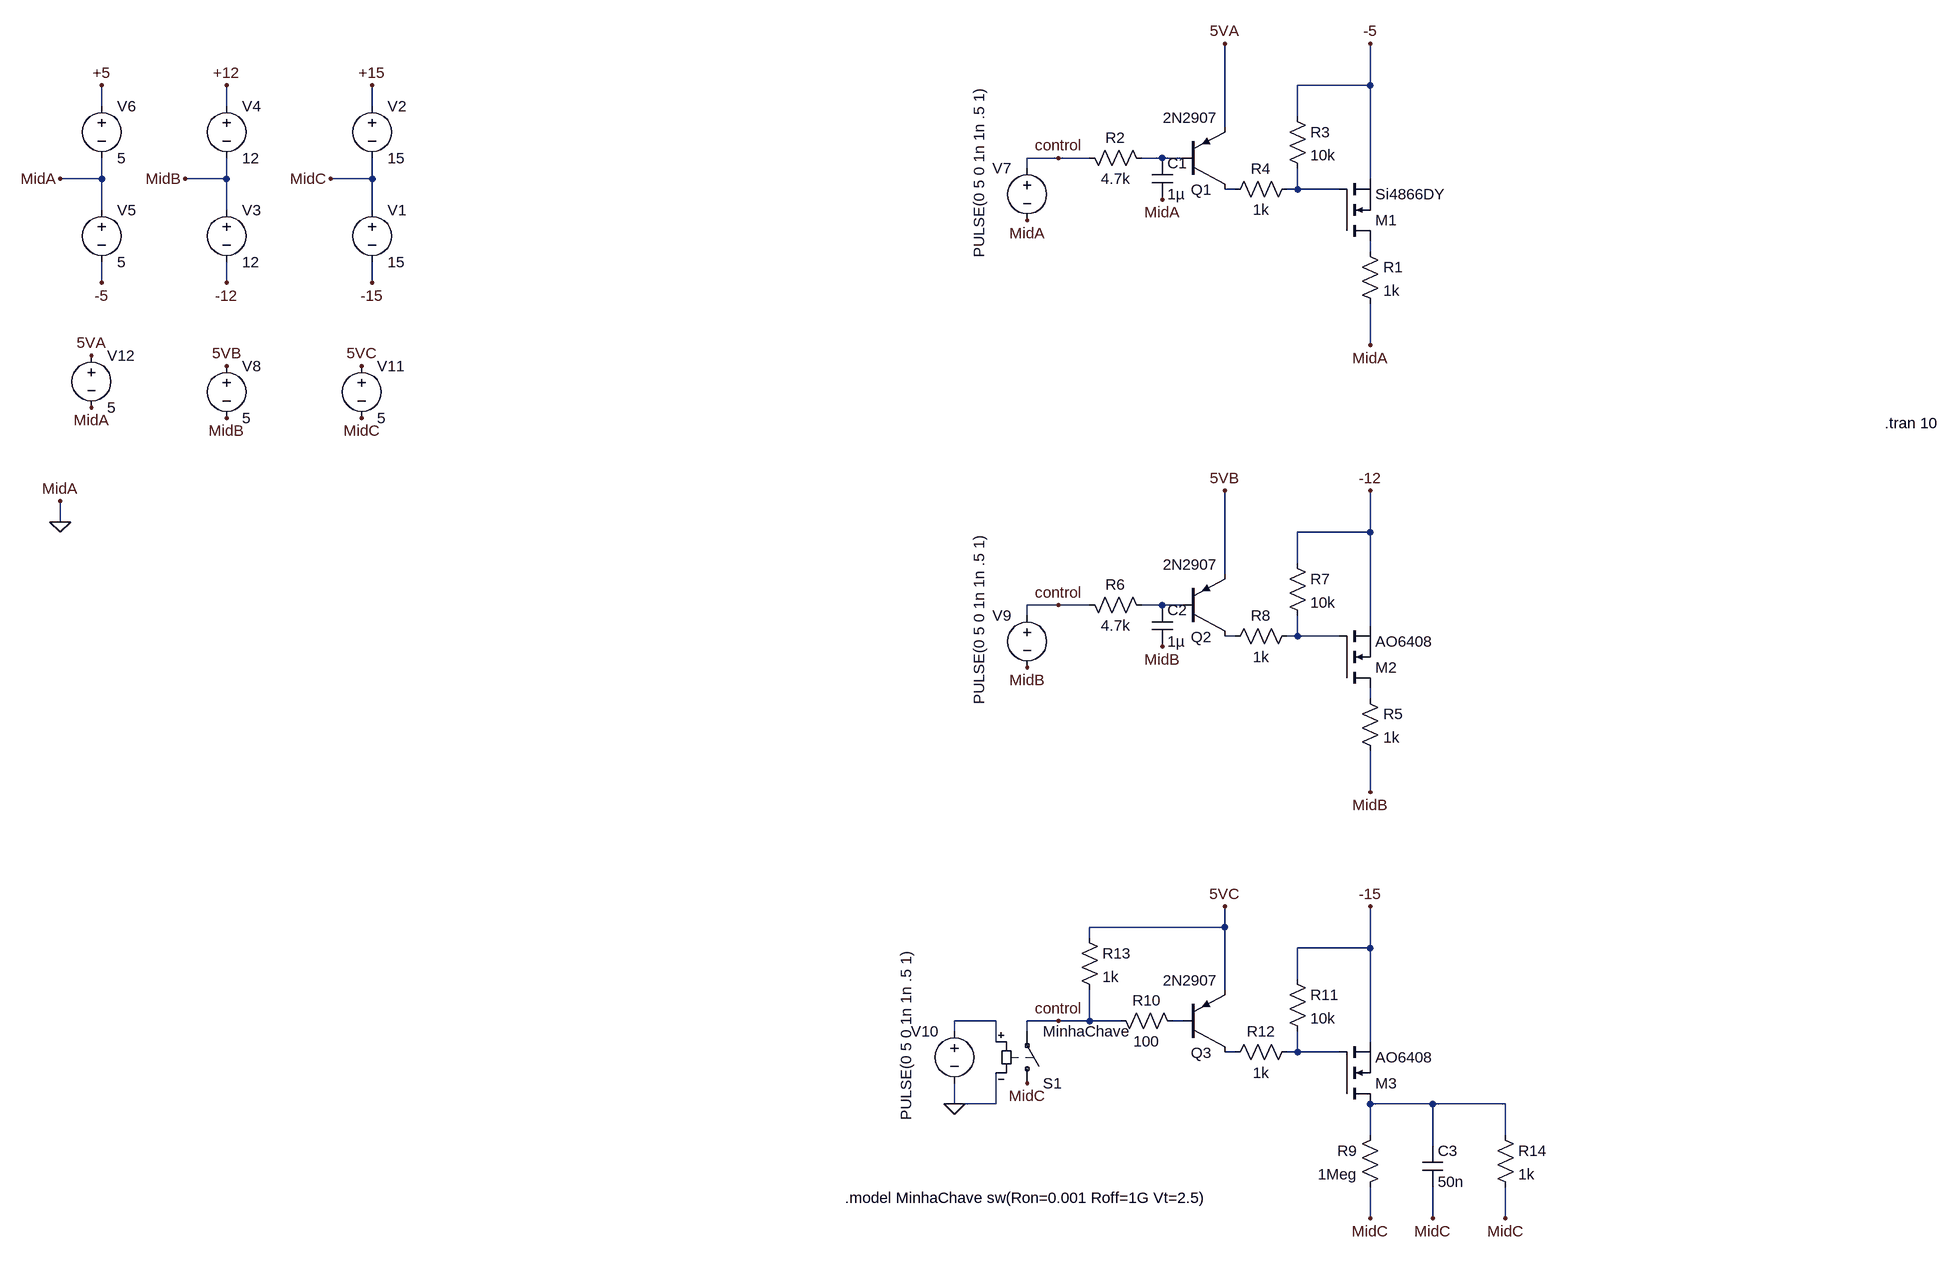
[diagram p0: schematic negativeSwitch.asc]
negativeSwitch.asc, the LTspice schematic file:
Version 4.1
SHEET 1 1944 1796
WIRE 416 -96 416 -160
WIRE 416 -96 304 -96
WIRE -1536 -64 -1536 -96
WIRE -1344 -64 -1344 -96
WIRE -1120 -64 -1120 -96
WIRE 304 -48 304 -96
WIRE 192 -32 192 -160
WIRE -64 16 -112 16
WIRE -16 16 -64 16
WIRE 96 16 64 16
WIRE 128 16 96 16
WIRE -112 32 -112 16
WIRE -1536 48 -1536 16
WIRE -1536 48 -1600 48
WIRE -1344 48 -1344 16
WIRE -1344 48 -1408 48
WIRE -1120 48 -1120 16
WIRE -1120 48 -1184 48
WIRE 416 48 416 -96
WIRE 208 64 192 64
WIRE 304 64 304 32
WIRE 304 64 288 64
WIRE 368 64 304 64
WIRE -1536 96 -1536 48
WIRE -1344 96 -1344 48
WIRE -1120 96 -1120 48
WIRE 416 160 416 144
WIRE -1536 208 -1536 176
WIRE -1344 208 -1344 176
WIRE -1120 208 -1120 176
WIRE 416 304 416 240
WIRE -1600 576 -1600 544
WIRE 416 592 416 528
WIRE 416 592 304 592
WIRE 304 640 304 592
WIRE 192 656 192 528
WIRE -64 704 -112 704
WIRE -16 704 -64 704
WIRE 96 704 64 704
WIRE 128 704 96 704
WIRE -112 720 -112 704
WIRE 416 736 416 592
WIRE 208 752 192 752
WIRE 304 752 304 720
WIRE 304 752 288 752
WIRE 368 752 304 752
WIRE 416 848 416 832
WIRE 416 992 416 928
WIRE 192 1200 192 1168
WIRE 192 1200 -16 1200
WIRE -16 1216 -16 1200
WIRE 416 1232 416 1168
WIRE 416 1232 304 1232
WIRE 304 1280 304 1232
WIRE 192 1296 192 1200
WIRE -160 1344 -224 1344
WIRE -64 1344 -112 1344
WIRE -16 1344 -16 1296
WIRE -16 1344 -64 1344
WIRE 32 1344 -16 1344
WIRE 128 1344 112 1344
WIRE -224 1360 -224 1344
WIRE -112 1360 -112 1344
WIRE -160 1376 -160 1344
WIRE 416 1376 416 1232
WIRE 208 1392 192 1392
WIRE 304 1392 304 1360
WIRE 304 1392 288 1392
WIRE 368 1392 304 1392
WIRE -224 1472 -224 1440
WIRE -160 1472 -160 1424
WIRE -160 1472 -224 1472
WIRE 512 1472 416 1472
WIRE 624 1472 512 1472
WIRE 416 1520 416 1472
WIRE 624 1520 624 1472
WIRE 512 1536 512 1472
WIRE 416 1648 416 1600
WIRE 512 1648 512 1600
WIRE 624 1648 624 1600
FLAG -1120 208 -15
FLAG -1120 -96 +15
FLAG -1184 48 MidC
FLAG -1344 336 5VB
FLAG -64 16 control
FLAG -1344 208 -12
FLAG -1344 -96 +12
FLAG -1536 208 -5
FLAG -1536 -96 +5
FLAG -1600 48 MidA
FLAG -64 704 control
FLAG -64 1344 control
FLAG 416 1168 -15
FLAG 416 -160 -5
FLAG 416 528 -12
FLAG -1408 48 MidB
FLAG 416 304 MidA
FLAG 96 80 MidA
FLAG -112 112 MidA
FLAG 416 992 MidB
FLAG 96 768 MidB
FLAG -112 800 MidB
FLAG 416 1648 MidC
FLAG -112 1440 MidC
FLAG -1136 336 5VC
FLAG -1136 416 MidC
FLAG -1344 416 MidB
FLAG -1552 320 5VA
FLAG -1552 400 MidA
FLAG 192 -160 5VA
FLAG 192 528 5VB
FLAG 192 1168 5VC
FLAG -1600 544 MidA
FLAG -1600 576 0
FLAG -224 1472 0
FLAG 512 1648 MidC
FLAG 624 1648 MidC
SYMBOL nmos 368 144 M180
SYMATTR InstName M1
SYMATTR Value Si4866DY
SYMBOL voltage -1120 80 R0
WINDOW 123 0 0 Left 0
WINDOW 39 0 0 Left 0
SYMATTR InstName V1
SYMATTR Value 15
SYMBOL voltage -1120 -80 R0
WINDOW 123 0 0 Left 0
WINDOW 39 0 0 Left 0
SYMATTR InstName V2
SYMATTR Value 15
SYMBOL res 400 144 R0
SYMATTR InstName R1
SYMATTR Value 1k
SYMBOL voltage -112 16 M0
WINDOW 3 74 -110 VRight 2
WINDOW 123 0 0 Left 0
WINDOW 39 0 0 Left 0
SYMATTR Value PULSE(0 5 0 1n 1n .5 1)
SYMATTR InstName V7
SYMBOL voltage -1344 320 R0
WINDOW 123 0 0 Left 0
WINDOW 39 0 0 Left 0
SYMATTR InstName V8
SYMATTR Value 5
SYMBOL res -32 0 M90
WINDOW 0 0 56 VBottom 2
WINDOW 3 32 56 VTop 2
SYMATTR InstName R2
SYMATTR Value 4.7k
SYMBOL res 288 -64 R0
SYMATTR InstName R3
SYMATTR Value 10k
SYMBOL pnp 128 64 M180
WINDOW 0 12 -1 Left 2
WINDOW 3 -31 110 Left 2
SYMATTR InstName Q1
SYMATTR Value 2N2907
SYMBOL cap 80 16 R0
SYMATTR InstName C1
SYMATTR Value 1µ
SYMBOL voltage -1344 80 R0
WINDOW 123 0 0 Left 0
WINDOW 39 0 0 Left 0
SYMATTR InstName V3
SYMATTR Value 12
SYMBOL voltage -1344 -80 R0
WINDOW 123 0 0 Left 0
WINDOW 39 0 0 Left 0
SYMATTR InstName V4
SYMATTR Value 12
SYMBOL voltage -1536 80 R0
WINDOW 123 0 0 Left 0
WINDOW 39 0 0 Left 0
SYMATTR InstName V5
SYMATTR Value 5
SYMBOL voltage -1536 -80 R0
WINDOW 123 0 0 Left 0
WINDOW 39 0 0 Left 0
SYMATTR InstName V6
SYMATTR Value 5
SYMBOL res 304 48 R90
WINDOW 0 0 56 VBottom 2
WINDOW 3 32 56 VTop 2
SYMATTR InstName R4
SYMATTR Value 1k
SYMBOL nmos 368 832 M180
SYMATTR InstName M2
SYMATTR Value AO6408
SYMBOL res 400 832 R0
SYMATTR InstName R5
SYMATTR Value 1k
SYMBOL voltage -112 704 M0
WINDOW 3 74 -110 VRight 2
WINDOW 123 0 0 Left 0
WINDOW 39 0 0 Left 0
SYMATTR Value PULSE(0 5 0 1n 1n .5 1)
SYMATTR InstName V9
SYMBOL res -32 688 M90
WINDOW 0 0 56 VBottom 2
WINDOW 3 32 56 VTop 2
SYMATTR InstName R6
SYMATTR Value 4.7k
SYMBOL res 288 624 R0
SYMATTR InstName R7
SYMATTR Value 10k
SYMBOL pnp 128 752 M180
WINDOW 0 12 -1 Left 2
WINDOW 3 -31 110 Left 2
SYMATTR InstName Q2
SYMATTR Value 2N2907
SYMBOL cap 80 704 R0
SYMATTR InstName C2
SYMATTR Value 1µ
SYMBOL res 304 736 R90
WINDOW 0 0 56 VBottom 2
WINDOW 3 32 56 VTop 2
SYMATTR InstName R8
SYMATTR Value 1k
SYMBOL nmos 368 1472 M180
SYMATTR InstName M3
SYMATTR Value AO6408
SYMBOL res 432 1504 M0
SYMATTR InstName R9
SYMATTR Value 1Meg
SYMBOL voltage -224 1344 M0
WINDOW 3 74 -110 VRight 2
WINDOW 123 0 0 Left 0
WINDOW 39 24 44 Left 2
SYMATTR Value PULSE(0 5 0 1n 1n .5 1)
SYMATTR InstName V10
SYMBOL res 16 1328 M90
WINDOW 0 0 56 VBottom 2
WINDOW 3 32 56 VTop 2
SYMATTR InstName R10
SYMATTR Value 100
SYMBOL res 288 1264 R0
SYMATTR InstName R11
SYMATTR Value 10k
SYMBOL pnp 128 1392 M180
WINDOW 0 12 -1 Left 2
WINDOW 3 -31 110 Left 2
SYMATTR InstName Q3
SYMATTR Value 2N2907
SYMBOL res 304 1376 R90
WINDOW 0 0 56 VBottom 2
WINDOW 3 32 56 VTop 2
SYMATTR InstName R12
SYMATTR Value 1k
SYMBOL voltage -1136 320 R0
WINDOW 123 0 0 Left 0
WINDOW 39 0 0 Left 0
SYMATTR InstName V11
SYMATTR Value 5
SYMBOL voltage -1552 304 R0
WINDOW 123 0 0 Left 0
WINDOW 39 0 0 Left 0
SYMATTR InstName V12
SYMATTR Value 5
SYMBOL res -32 1200 R0
SYMATTR InstName R13
SYMATTR Value 1k
SYMBOL sw -112 1456 M180
SYMATTR InstName S1
SYMATTR Value MinhaChave
SYMBOL cap 496 1536 R0
SYMATTR InstName C3
SYMATTR Value 50n
SYMBOL res 608 1504 R0
SYMATTR InstName R14
SYMATTR Value 1k
TEXT 1208 424 Left 2 !.tran 10
TEXT -392 1616 Left 2 !.model MinhaChave sw(Ron=0.001 Roff=1G Vt=2.5)

The netlist it stands for:
* negativeSwitch.asc
M1 N004 N003 -5 -5 Si4866DY
V1 MidC -15 15
V2 +15 MidC 15
R1 N004 0 1k
V7 control 0 PULSE(0 5 0 1n 1n .5 1)
V8 5VB MidB 5
R2 control N001 4.7k
R3 -5 N003 10k
Q1 N002 N001 5VA 0 2N2907
C1 N001 0 1µ
V3 MidB -12 12
V4 +12 MidB 12
V5 0 -5 5
V6 +5 0 5
R4 N003 N002 1k
M2 N008 N007 -12 -12 AO6408
R5 N008 MidB 1k
V9 control MidB PULSE(0 5 0 1n 1n .5 1)
R6 control N005 4.7k
R7 -12 N007 10k
Q2 N006 N005 5VB 0 2N2907
C2 N005 MidB 1µ
R8 N007 N006 1k
M3 N013 N012 -15 -15 AO6408
R9 N013 MidC 1Meg
V10 N009 0 PULSE(0 5 0 1n 1n .5 1)
R10 control N010 100
R11 -15 N012 10k
Q3 N011 N010 5VC 0 2N2907
R12 N012 N011 1k
V11 5VC MidC 5
V12 5VA 0 5
R13 5VC control 1k
S1 MidC control N009 0 MinhaChave
C3 N013 MidC 50n
R14 N013 MidC 1k
.model NPN NPN
.model PNP PNP
.lib standard.bjt
.model NMOS NMOS
.model PMOS PMOS
.lib standard.mos
.tran 10
.model MinhaChave sw(Ron=0.001 Roff=1G Vt=2.5)
.backanno
.end